# EAGLE design CCM_0016 (EAGLE 9.0.1)
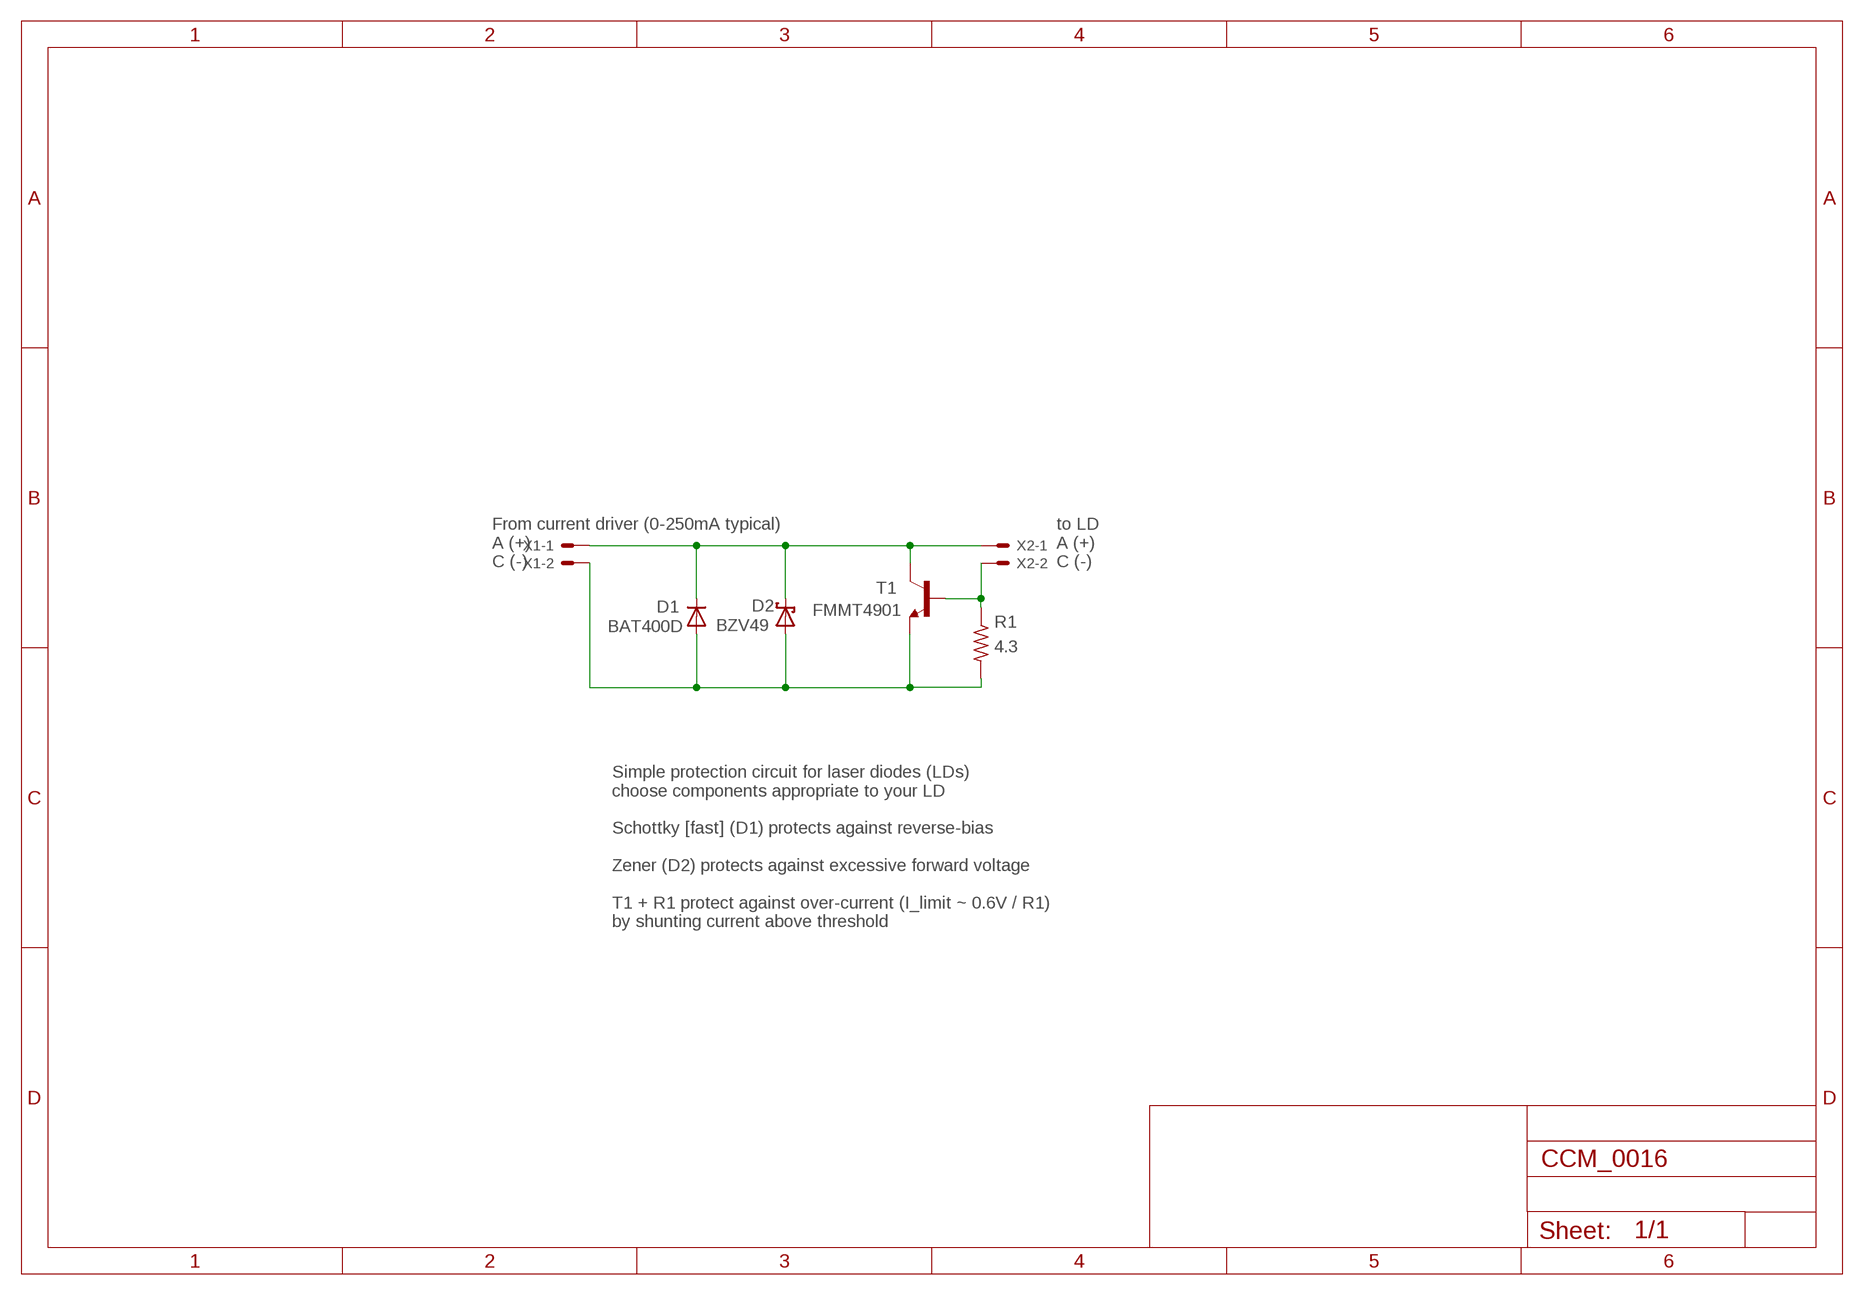
[diagram p0: schematic, sheet 1]

## Parts
D1  BAT400D  HSMS-2850  [SOT23]
D2  BZV49  [SOT89]
R1  4.3  RESISTOR2512  [2512]
T1  FMMT4901  MMBT4401LT1-NPN-SOT23-BEC  [SOT23-BEC]
X1  22-23-2021  [22-23-2021]
X2  22-23-2021  [22-23-2021]

## Nets
N$4: R1.1 T1.B X2.2
N$5: D1.1(A) D2.1(A) D2.3(A) R1.2 T1.E X1.2
N$7: D1.3(C) D2.2(C) D2.2@1(C) T1.C X1.1 X2.1

## Notes on the sheet
- From current driver (0-250mA typical)
  A (+)
  C (-)
- to LD
  A (+)
  C (-)
- Simple protection circuit for laser diodes (LDs)
  choose components appropriate to your LD
  
  Schottky [fast] (D1) protects against reverse-bias
  
  Zener (D2) protects against excessive forward voltage
  
  T1 + R1 protect against over-current (I_limit ~ 0.6V / R1)
  by shunting current above threshold

## Library data of the parts
D1 = avago:HSMS-2850: Surface Mount Microwave Schottky Detector Diodes Source: Data sheet <http://www.farnell.com/datasheets/461166.pdf>
D2 = noah:BZV49
R1 = noah:RESISTOR: RESISTOR, American symbol
T1 = transistor:*-NPN-: NPN Transistror BF959 corrected 2008.03.06
X1 X2 = con-molex:22-23-2021: .100" (2.54mm) Center Header - 2 Pin; MF: MOLEX; MPN: 22-23-2021; OC_FARNELL: 1462926; OC_NEWARK: 25C3832

## Net classes
1 standard: width 0.61 mm, clearance 0.254 mm

## Board
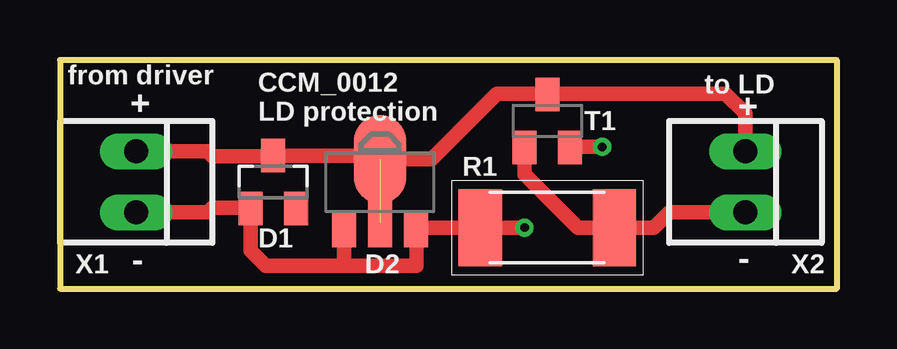
[diagram p1: board, top side]
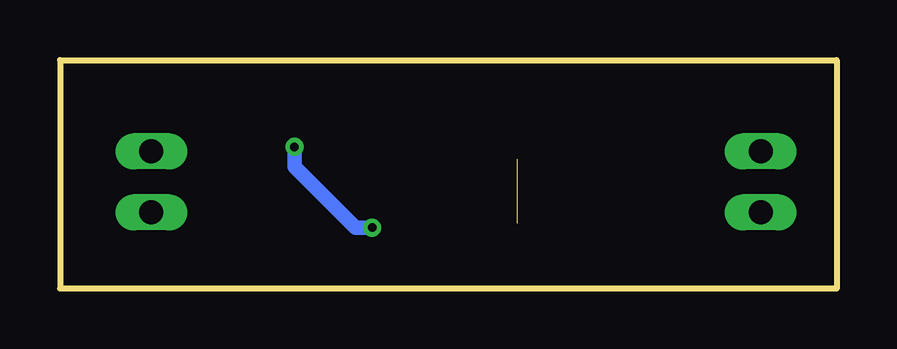
[diagram p2: board, bottom side, seen from below]

Size 32.38 x 9.53 mm. Coordinates in mm from the lower left corner, seen from the top.
Outline: 0,0 32.38,0 32.38,9.53 0,9.53 0,0
Copper layers (1*16): Top 0.035mm / dielectric 1.5mm / Bottom 0.035mm
Design rules "default *": minimum track width 10mil, minimum drill 10mil, track to track 7mil, track to pad 7mil, pad to pad 7mil, via to via 7mil, smd to smd 7mil, copper to edge 10mil, drill to drill 8mil, minimum pad ring 10mil, minimum via ring 8mil, stop-mask expansion 4mil, vias tented up to drill 0mil, thermal gap 10mil

### Footprints (pad centres in the part's own frame; a part is rotated, then mirrored left to right if it is on the bottom)
SOT23 = smd 1 x 1.4: 1 -0.95,-1.1; 2 0.95,-1.1; 3 0,1.1
SOT89 = smd 1 x 1.5: 1 -1.499,-1.981; 3 1.499,-1.981 | smd 1 x 2: 2 0,-1.727 | smd 2.2 x 3.7: 2@1 0,0.94
2512 = smd 1.8 x 3.2: 1 -2.8,0; 2 2.8,0
SOT23-BEC = smd 1 x 1.4: B -0.95,-1.1; C 0,1.1; E 0.95,-1.1
22-23-2021 = drill 1 long: 1 -1.27,0; 2 1.27,0

### Placement (x,y rotation side)
D1  8.89,4.45 0 top
D2  13.34,4.45 0 top
R1  20.32,2.54 180 top
T1  20.32,6.99 0 top
X1  3.17,4.45 270 top
X2  28.57,4.45 270 top

### Tracks (layer width: path | path; a pad name or v marks a point on that pad's centre or on a via)
N$4
  Top 0.61: X2.2 25.4,3.17 24.77,2.54 R1.1 21.59,2.54 19.37,4.76 T1.B
N$5  (via drill 0.35)
  Top 0.61: X1.2 6.16,3.17 6.35,3.37 7.92,3.37 D1.1 7.94,1.58 8.57,0.95 11.87,0.95 | 11.87,0.95 14.86,0.95 14.86,2.44 D2.3 14.91,2.54 R1.2 v19.37,2.54 | D2.1 11.84,0.99 11.87,0.95 | v22.61,5.91 21.29,5.91 T1.E
  Bottom 0.61: v19.37,2.54 20.07,2.54 22.61,5.08 v22.61,5.91
N$7  (1 unrouted)
  Top 0.61: X1.1 6.16,5.71 6.35,5.52 8.87,5.52 D1.3 13.18,5.54 D2.2@1 15.48,5.38 18.22,8.13 20.36,8.13 | X2.1 28.57,7.3 27.75,8.13 20.36,8.13 | 20.36,8.13 T1.C

### Text on the board
tNames: from driver | to LD | + | CCM_0012 / LD protection | + | - | -